# EAGLE design atsamdg21_rtc (EAGLE 9.5.1)
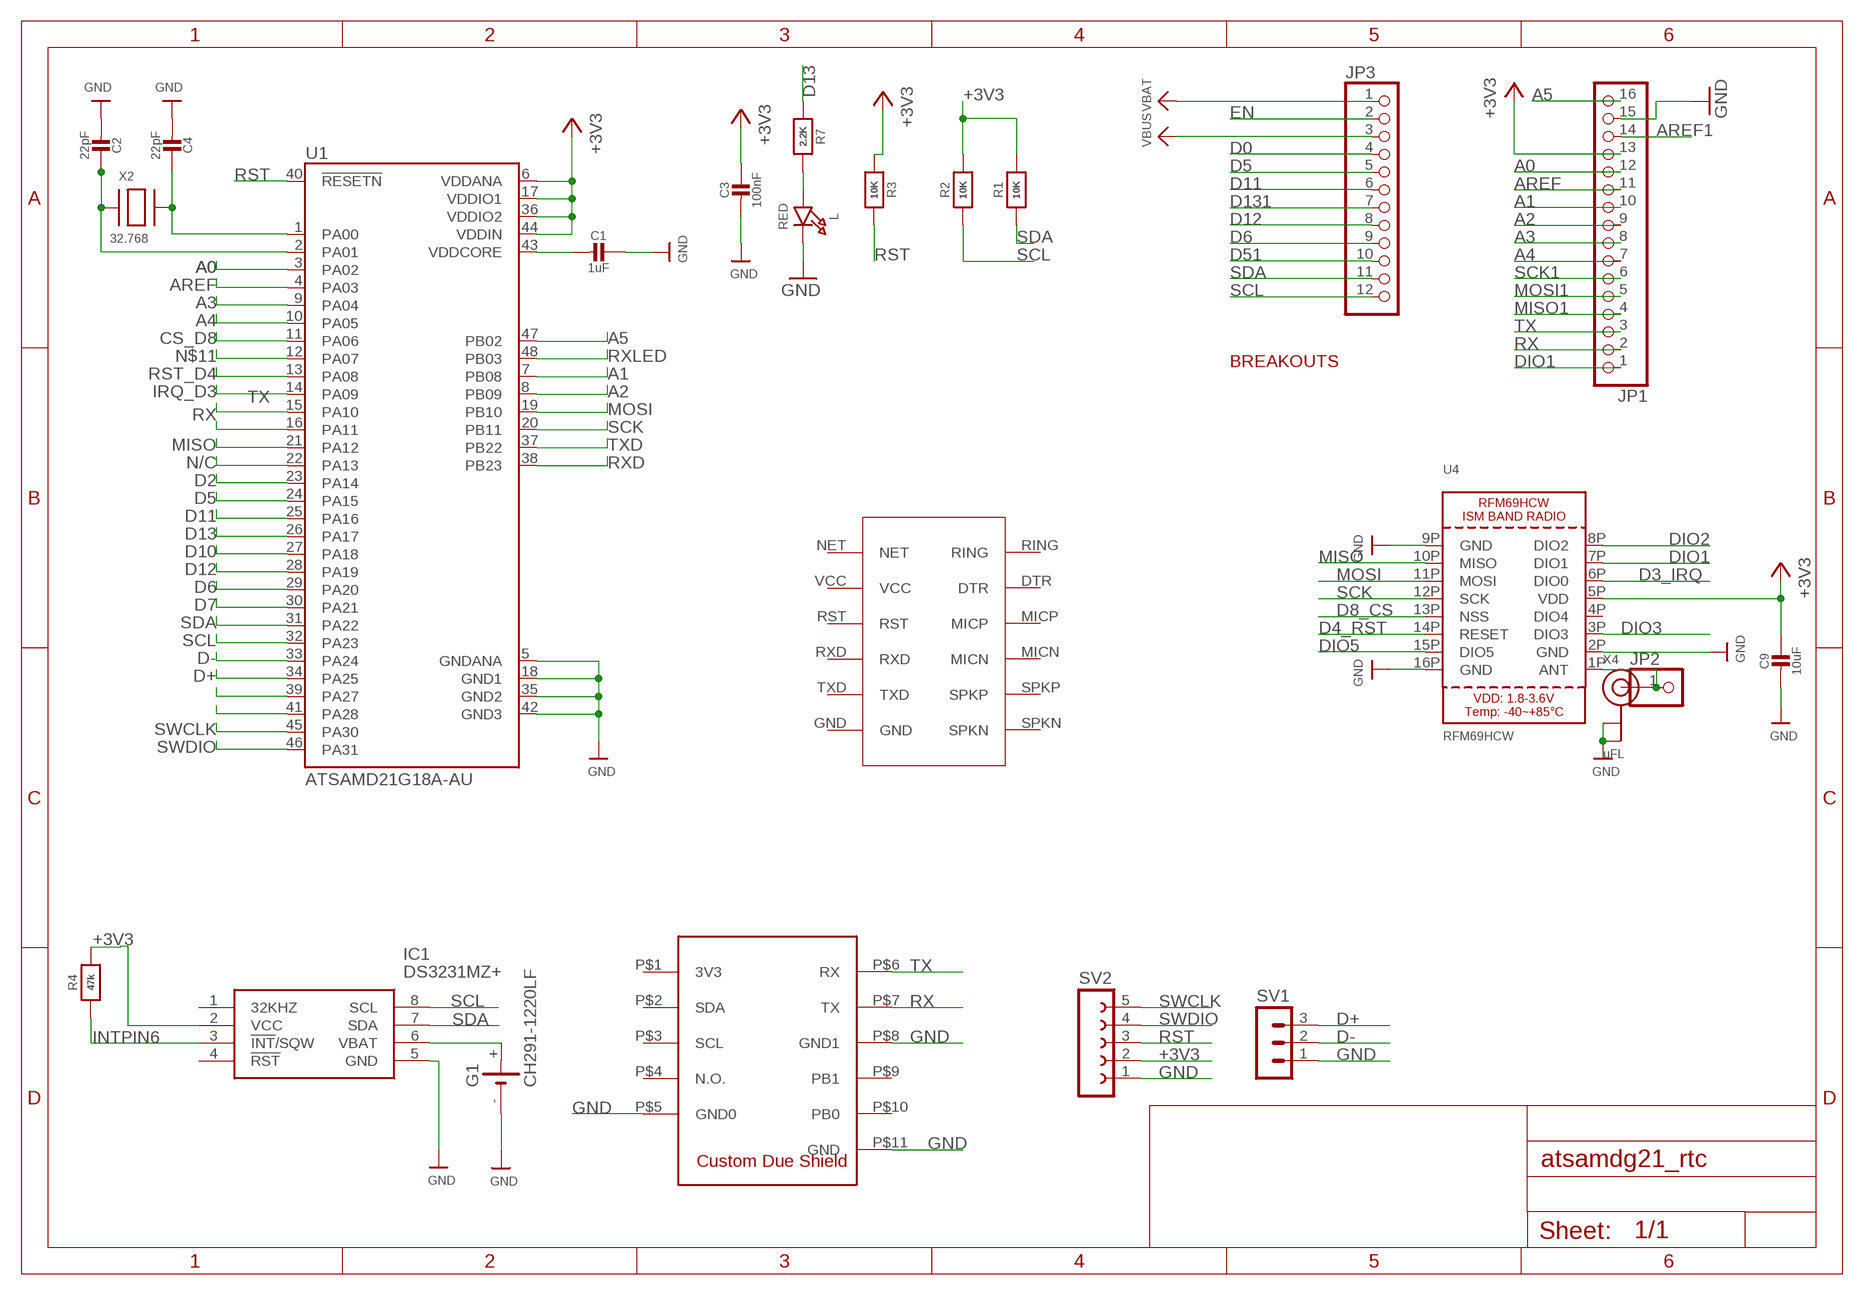
[diagram p0: schematic, sheet 1]

## Parts
C1  1uF  CAP_CERAMIC0603_NO  [0603-NO]
C2  22pF  CAP_CERAMIC0603_NO  [0603-NO]
C3  100nF  CAP_CERAMIC0603_NO  [0603-NO]
C4  22pF  CAP_CERAMIC0603_NO  [0603-NO]
C9  10uF  CAP_CERAMIC0805-NOOUTLINE  [0805-NO]
G1  CH291-1220LF  [CH291-1220LF]
IC1  DS3231MZ+  [SOIC127P600X175-8N]
JP1  HEADER-1X16ROUND  [1X16_ROUND]
JP2  HEADER-1X1ROUND  [1X01_ROUND]
JP3  HEADER-1X12  [1X12_ROUND]
L  RED  LED0805_NOOUTLINE  [CHIPLED_0805_NOOUTLINE]
R1  10K  RESISTOR_0603_NOOUT  [0603-NO]
R2  10K  RESISTOR_0603_NOOUT  [0603-NO]
R3  10K  RESISTOR_0603_NOOUT  [0603-NO]
R4  47k  RESISTOR_0603_NOOUT  [0603-NO]
R7  2.2K  RESISTOR_0603_NOOUT  [0603-NO]
SV1  MA03-1  [MA03-1]
SV2  FE05-1  [FE05-1]
U1  ATSAMD21G18A-AU  [QFP50P900X900X120-48N]
U4  RFM69HCW  RFM69HCW_SMT  [RFMHCW_SMT]
U$7  SIM800L_MODULE  [SIM800L]
U$9  DUE_PADS  [DUESHIELD]
X2  32.768  XTAL-3.2X1.5  [XTAL3215]
X4  uFL  ANTENNA_U.FL  [U.FL]

## Nets
+3V3: C3.1 C9.1 IC1.2(VCC) JP1.13 R1.2 R2.2 R3.1 R4.2 SV2.2 U1.6(VDDANA) U1.17(VDDIO1) U1.36(VDDIO2) U1.44(VDDIN) U4.5P(VDD)
A0: JP1.12 U1.3(PA02)
A1: JP1.10 U1.7(PB08)
A2: JP1.9 U1.8(PB09)
A3: JP1.8 U1.9(PA04)
A4: JP1.7 U1.10(PA05)
A5: JP1.16 U1.47(PB02)
ANT: JP2.1 U4.1P(ANT) X4.3(SIGNAL)
AREF: JP1.11 U1.4(PA03)
AREF1: JP1.14
CS_D8: U1.11(PA06)
D0: JP3.4
D2: U1.23(PA14)
D3_IRQ: U4.6P(DIO0)
D4_RST: U4.14P(RESET)
D5: JP3.5 U1.24(PA15)
D6: JP3.9 U1.29(PA20)
D7: U1.30(PA21)
D8_CS: U4.13P(NSS)
D10: U1.27(PA18)
D11: JP3.6 U1.25(PA16)
D12: JP3.8 U1.28(PA19)
D13: R7.1 U1.26(PA17)
D51: JP3.10
D131: JP3.7
D+: SV1.3 U1.34(PA25)
D-: SV1.2 U1.33(PA24)
DIO1: JP1.1 U4.7P(DIO1)
DIO2: U4.8P(DIO2)
DIO3: U4.3P(DIO3)
DIO5: U4.15P(DIO5)
EN: JP3.2
GND: C1.1 C2.2 C3.2 C4.2 C9.2 G1.- IC1.5(GND) JP1.15 L.C SV1.1 SV2.1 U1.5(GNDANA) U1.18(GND1) U1.35(GND2) U1.42(GND3) U4.2P(GND) U4.9P(GND) U4.16P(GND) U$9.P$5(GND0) U$9.P$8(GND1) U$9.P$11(GND) X4.1(GND) X4.2(GND)
INTPIN6: IC1.3(!INT!/SQW) R4.1
IRQ_D3: U1.14(PA09)
MISO: U1.21(PA12) U4.10P(MISO)
MISO1: JP1.4
MOSI: U1.19(PB10) U4.11P(MOSI)
MOSI1: JP1.5
N$1: C1.2 U1.43(VDDCORE)
N$2: G1.+ IC1.6(VBAT)
N$5: C2.1 U1.2(PA01) X2.P$1
N$7: C4.1 U1.1(PA00) X2.P$2
N$11: U1.12(PA07)
N$30: U1.39(PA27)
N$31: U1.41(PA28)
N$40: L.A R7.2
N/C: U1.22(PA13)
RST: R3.2 SV2.3 U1.40(!RESETN)
RST_D4: U1.13(PA08)
RX: JP1.2 U1.16(PA11) U$9.P$7(TX)
RXD: U1.38(PB23)
RXLED: U1.48(PB03)
SCK: U1.20(PB11) U4.12P(SCK)
SCK1: JP1.6
SCL: IC1.8(SCL) JP3.12 R2.1 U1.32(PA23)
SDA: IC1.7(SDA) JP3.11 R1.1 U1.31(PA22)
SWCLK: SV2.5 U1.45(PA30)
SWDIO: SV2.4 U1.46(PA31)
TX: JP1.3 U1.15(PA10) U$9.P$6(RX)
TXD: U1.37(PB22)
VBAT: JP3.1
VBUS: JP3.3
Unconnected: IC1.1(32KHZ) IC1.4(!RST) U4.4P(DIO4) U$7.DTR U$7.GND U$7.MICN U$7.MICP U$7.NET U$7.RING U$7.RST U$7.RXD U$7.SPKN U$7.SPKP U$7.TXD U$7.VCC U$9.P$1(3V3) U$9.P$2(SDA) U$9.P$3(SCL) U$9.P$4(N.O.) U$9.P$9(PB1) U$9.P$10(PB0)

## Notes on the sheet
- BREAKOUTS

## Library data of the parts
C1-C4 C9 = microbuilder:CAP_CERAMIC: Ceramic Capacitors For new designs, use the packages preceded by an '_' character since they are more reliable: The following footprints should be used on most boards: _0402 - Standard footprint for regular board layouts _0603 - Standard footprint for regular board layouts _0805 - Standard footprint for regular board layouts _1206 - Standard footprint for regular board layouts For extremely tight-pitch boards where space is at a premium, the following 'micro-pitch' footprints can be used (smaller pads, no silkscreen outline, etc.): _0402MP - Micro-pitch footprint for very dense/compact boards _0603MP - Micro-pitch footprint for very dense/compact boards _0805MP - Micro-pitch footprint for very dense/compact boards _1206MP - Micro-pitch footprint for very dense/compact boards
G1 = battery:CH291-1220LF: Battery Holder, SMT, 12mm multicomp PART NO. CH291-1220LF Source: Data sheet <http://www.farnell.com/datasheets/1505860.pdf>
IC1 = DS3231MZ+:DS3231MZ+: Real Time Clock 5+/-ppm RTC Source: Datasheet <http://uk.rs-online.com/web/p/products/1897249>; DESCRIPTION: Real Time Clock 5+/-ppm RTC; HEIGHT: 1.75mm; MANUFACTURER_NAME: Maxim Integrated; MANUFACTURER_PART_NUMBER: DS3231MZ+; RS_PART_NUMBER: 1897249; RS_PRICE-STOCK: http://uk.rs-online.com/web/p/products/1897249
JP1 = microbuilder:HEADER-1X16: PIN HEADER
JP2 = microbuilder:HEADER-1X1: PIN HEADER
JP3 = microbuilder:HEADER-1X12
L = microbuilder:LED: LED 0603 - 0603 Surface Mount Package 2mA: Green LED - Low Power (3.9mcd, 2ma, 1.7Vf) - Digikey: 475-2709-2-ND Orange LED - Low Power (9.8mcd, 2ma, 1.8Vf) - Digikey: 475-1194-2-ND Red LED - Low Power (5mcd, 2ma, 1.8Vf) - Digikey: 475-1195-2-ND Yellow LED - Low Power (7mcd, 2ma, 1.8Vf) - Digikey: 475-1196-2-ND 5mA: Blue LED - Low Power (17mcd, 5ma, 2.9Vf) - Digikey: LNJ937W8CRACT-ND 0805 - 0805 Surface Mount Package 2mA: Red LED (8.8mcd, 2mA, 1.8Vf, Clear) - Low Power [Digikey: 475-2510-1-ND] Green LED (5mcd, 2mA, 1.8Vf, Clear) - Low Power [Digikey: 475-2730-1-ND] Yellow LED (11.3mcd, 2mA, 1.8Vf, Clear) - Low Power [Digikey: 475-2555-1-ND] 20mA: Red LED (104mcd, 20mA, Diffused) - LS R976 [Digikey: 475-1278-6-ND] Red LED (12mcd, 20mA, 2.0Vf, Clear) - APT2012EC [Digikey: 754-1128-1-ND] Green LED (15mcd, 20mA, 2.2Vf, Clear) - APT2012GC [Digikey: 754-1131-1-ND] Orange LED (160mcd, 20mA, 2.1Vf, Clear) - APT2012SECK [Digikey: 754-1130-1-ND] 1206 - 1206 Surface Mount Package Green LED (26mcd, 20mA, Diffused) - LG N971 [Digikey: 475-1407-6-ND] Red LED (15mcd, 20mA, Diffused) - LH N974 [Digikey: 475-1416-6-ND] Cree - Cree High-Power Surface Mount LEDs XPEBWT-L1-0000-00D50 - White 111lm 350mA 2.9Vf 6200K 110° XTEAWT-00-0000-00000LEE3 - White 114lm 350mA 2.85Vf 5000K 115° Everlight - Everlight 45-21 Series Surface Mount LEDs 45-21/QK2C-B2832AC2CB2/2T - Warm White 2000mcd 20mA 3.25Vf 3050K 120° 45-21/LK2C-B38452C4CB2/2T - Nuetral White 2000mcd 20mA 3.25Vf 4150K 120° 45-21/LK2C-B50634C6CB2/2T - Cold White 2200mcd 20mA 3.25Vf 5650K 120° PLCC2 Reverse Mount LS T77K-J1L2-1-0-2-R18-Z - Red 11.25mcd 2mA 1.8Vf 630nm 120° LO T77K-L1M2-24-Z - Orange 19.6mcd 2mA 1.8Vf 606nm 120° LY T77K-K2M1-26-Z - Yellow 15.7mcd 2mA 1.8Vf 587nm 120°
R1-R4 R7 = microbuilder:RESISTOR: Resistors For new designs, use the packages preceded by an '_' character since they are more reliable: The following footprints should be used on most boards: _0402 - Standard footprint for regular board layouts _0603 - Standard footprint for regular board layouts _0805 - Standard footprint for regular board layouts _1206 - Standard footprint for regular board layouts For extremely tight-pitch boards where space is at a premium, the following 'micro-pitch' footprints can be used (smaller pads, no silkscreen outline, etc.): _0402MP - Micro-pitch footprint for very dense/compact boards _0603MP - Micro-pitch footprint for very dense/compact boards _0805MP - Micro-pitch footprint for very dense/compact boards _1206MP - Micro-pitch footprint for very dense/compact boards
SV1 = con-lstb:MA03-1: PIN HEADER; OC_FARNELL: unknown; OC_NEWARK: unknown
SV2 = con-lsta:FE05-1: FEMALE HEADER; OC_FARNELL: unknown; OC_NEWARK: unknown
U1 = ATSAMD21G18A-AU:ATSAMD21G18A-AU: Cortex-M0+, 256KB FLASH, 32KB SRAM, USB, DMA, T&R - 48TQFP IND TEMP, GREEN, 1.6-3.6V, 48MHz; AVAILABILITY: Unavailable; DESCRIPTION: SAMD21G Series 256 kB Flash 32 kB SRAM 48 MHz 32-Bit Microcontroller - TQFP-48; MF: Microchip; MP: ATSAMD21G18A-AU; PACKAGE: TQFP-48 Microchip; PRICE: None
U4 = microbuilder:RFM69HCW: RFM69HCW - ISM Band RF Transceiver
U$7 = sim800L_module:SIM800L_MODULE
U$9 = due_shield_pad:DUE_PADS
X2 = adafruit2:XTAL: Low cost SMT crystals, no capacitors included http://www.ladyada.net/library/eagle
X4 = microbuilder:ANTENNA_U.FL: U.FL Antenna Connector

## Board
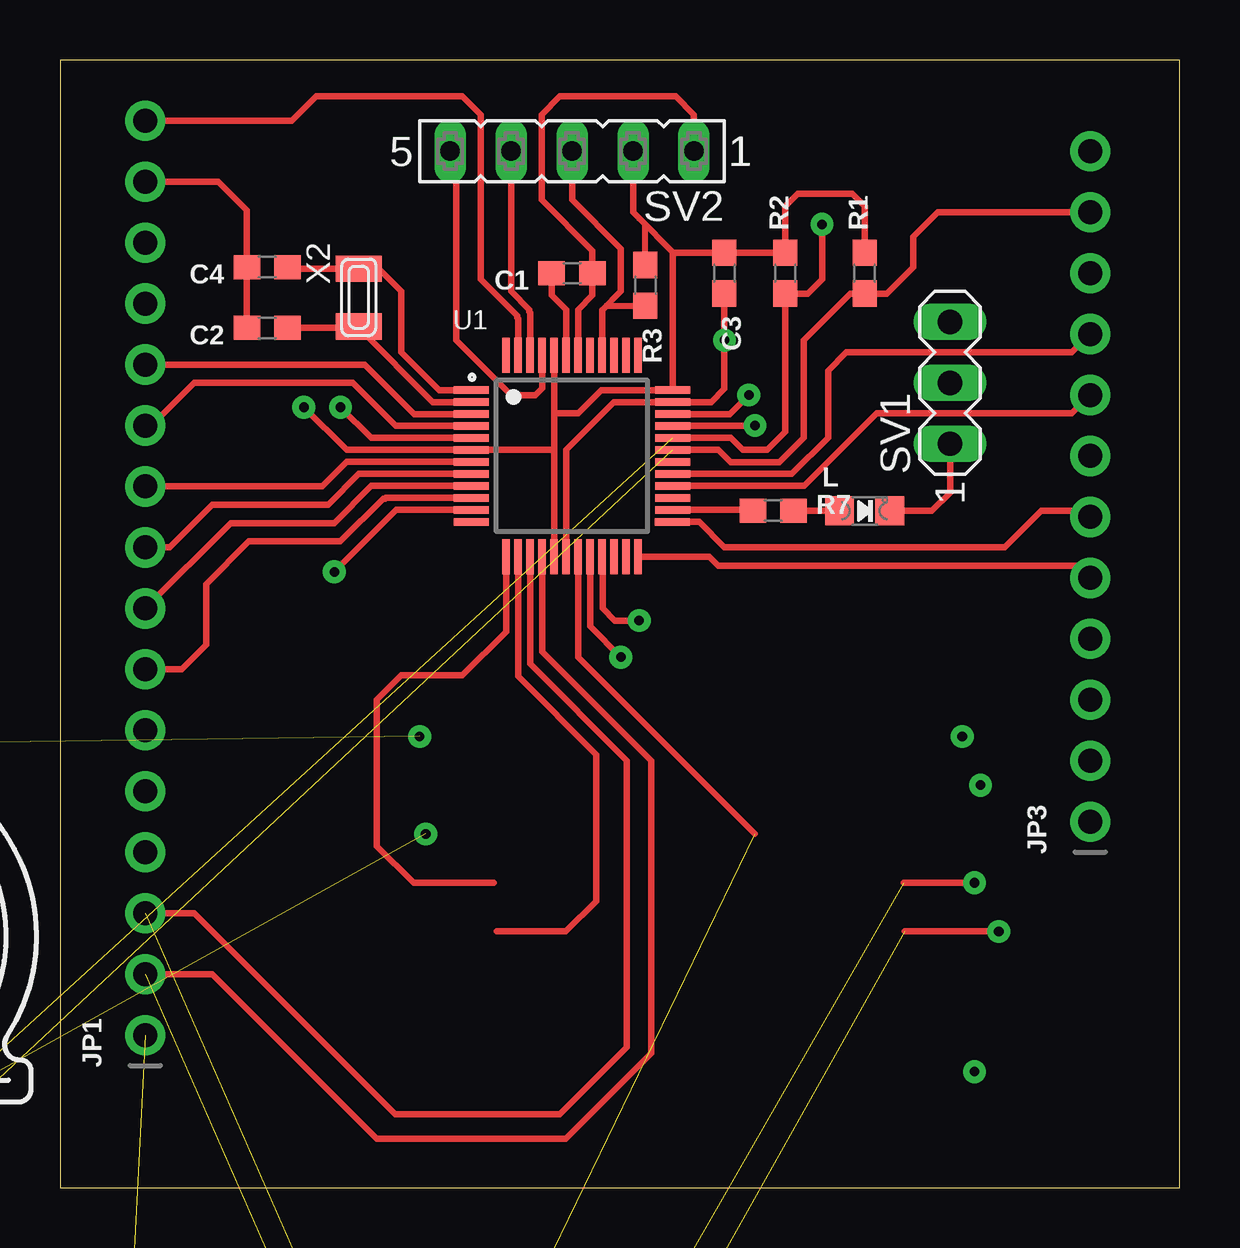
[diagram p1: board, top side]
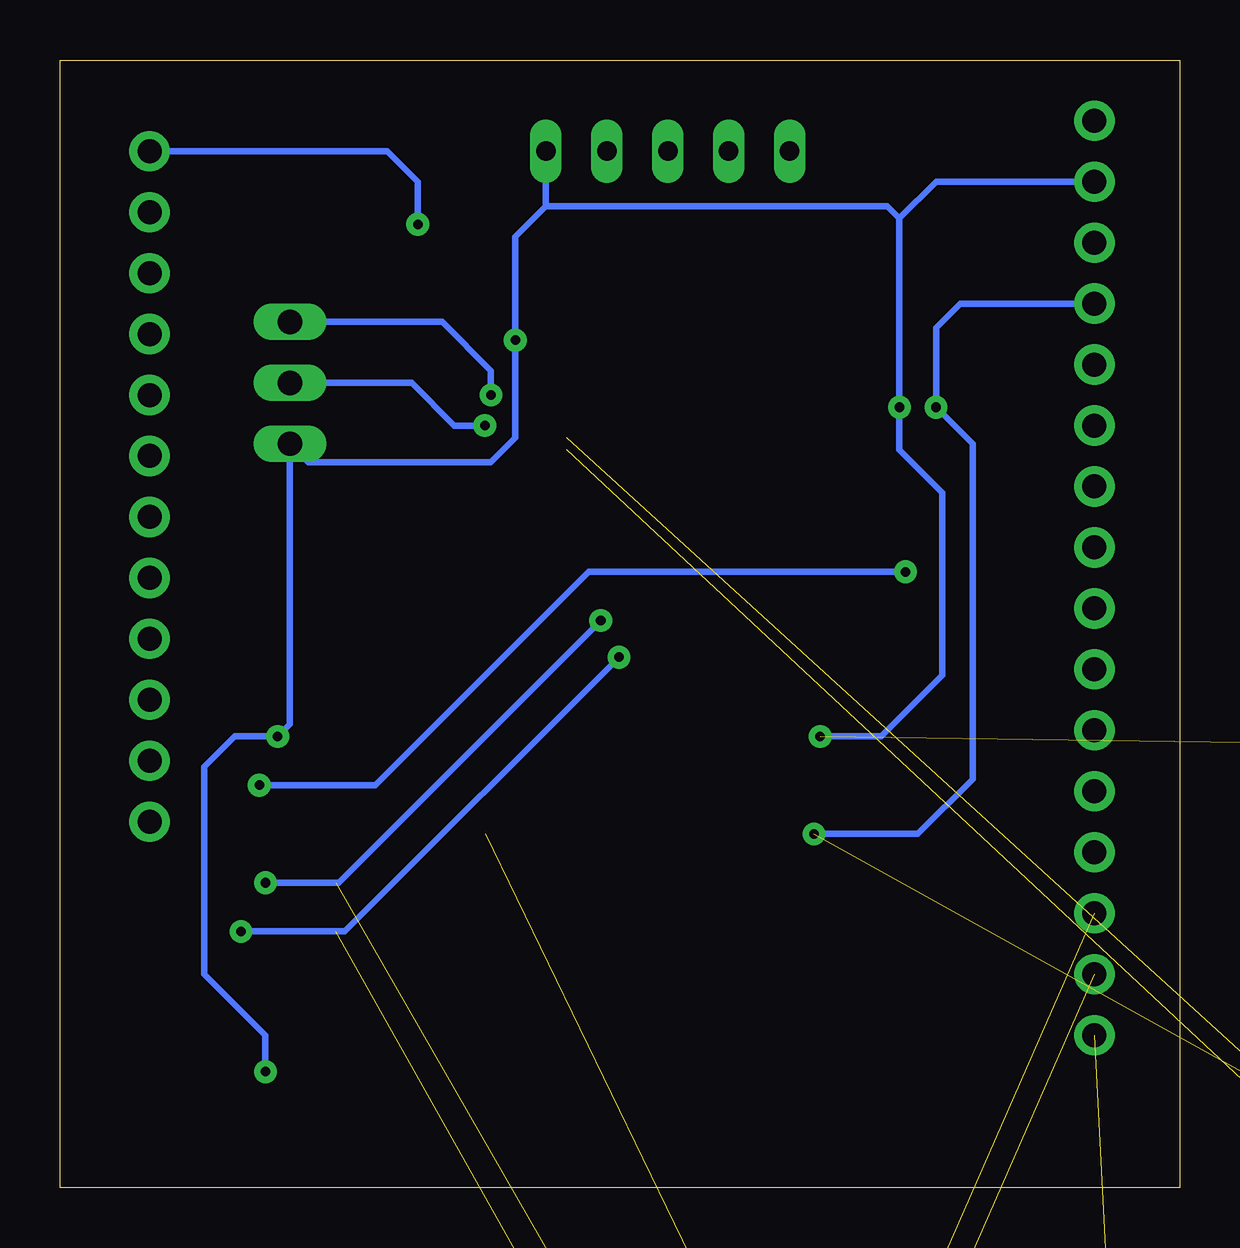
[diagram p2: board, bottom side, seen from below]

Size 46.66 x 46.98 mm. Coordinates in mm from the lower left corner, seen from the top.
Outline: 0,0 46.66,0 46.66,46.98 0,46.98 0,0
Copper layers (1*16): Top 0.035mm / dielectric 1.5mm / Bottom 0.035mm
Design rules "default": minimum track width 6mil, minimum drill 0.35mm, track to track 6mil, track to pad 6mil, pad to pad 6mil, via to via 6mil, smd to smd 6mil, copper to edge 40mil, drill to drill 6mil, minimum pad ring 10mil, minimum via ring 8mil, stop-mask expansion 4mil, vias tented up to drill 0mil, thermal gap 10mil

### Footprints (pad centres in the part's own frame; a part is rotated, then mirrored left to right if it is on the bottom)
0603-NO = smd 1.1 x 1: 1 -0.85,0; 2 0.85,0
0805-NO = smd 1.24 x 1.5: 1 -0.95,0; 2 0.95,0
CH291-1220LF = smd 2.3 x 3.66: + 0,-2.296 | smd 2.3 x 4.3: - 0,14.146 | hole 1.3: 0,2 | hole 1: 0,9.5
SOIC127P600X175-8N = smd 1.525 x 0.65: 1 -2.712,1.905; 2 -2.712,0.635; 3 -2.712,-0.635; 4 -2.712,-1.905; 5 2.712,-1.905; 6 2.712,-0.635; 7 2.712,0.635; 8 2.712,1.905
1X16_ROUND = drill 1 pad 1.676: 1 -19.05,0; 2 -16.51,0; 3 -13.97,0; 4 -11.43,0; 5 -8.89,0; 6 -6.35,0; 7 -3.81,0; 8 -1.27,0; 9 1.27,0; 10 3.81,0; 11 6.35,0; 12 8.89,0; 13 11.43,0; 14 13.97,0; 15 16.51,0; 16 19.05,0
1X01_ROUND = drill 1 pad 1.676: 1 0,0
1X12_ROUND = drill 1 pad 1.676: 1 -13.97,0; 2 -11.43,0; 3 -8.89,0; 4 -6.35,0; 5 -3.81,0; 6 -1.27,0; 7 1.27,0; 8 3.81,0; 9 6.35,0; 10 8.89,0; 11 11.43,0; 12 13.97,0
CHIPLED_0805_NOOUTLINE = smd 1.2 x 1.2: A 0,-1.05; C 0,1.05
MA03-1 = drill 1.016 long: 1 -2.54,0; 2 0,0; 3 2.54,0
FE05-1 = drill 0.813 long: 1 -5.08,0; 2 -2.54,0; 3 0,0; 4 2.54,0; 5 5.08,0
QFP50P900X900X120-48N = smd 1.45 x 0.3: 1 -4.2,2.75; 2 -4.2,2.25; 3 -4.2,1.75; 4 -4.2,1.25; 5 -4.2,0.75; 6 -4.2,0.25; 7 -4.2,-0.25; 8 -4.2,-0.75; 9 -4.2,-1.25; 10 -4.2,-1.75; 11 -4.2,-2.25; 12 -4.2,-2.75; 25 4.17,-2.75; 26 4.2,-2.25; 27 4.2,-1.75; 28 4.2,-1.25; 29 4.2,-0.75; 30 4.2,-0.25; 31 4.2,0.25; 32 4.2,0.75; 33 4.2,1.25; 34 4.2,1.75; 35 4.2,2.25; 36 4.2,2.75 | smd 0.3 x 1.45: 13 -2.75,-4.2; 14 -2.25,-4.2; 15 -1.75,-4.2; 16 -1.25,-4.2; 17 -0.75,-4.2; 18 -0.25,-4.2; 19 0.25,-4.2; 20 0.75,-4.2; 21 1.25,-4.2; 22 1.75,-4.2; 23 2.25,-4.2; 24 2.75,-4.2; 37 2.75,4.2; 38 2.25,4.2; 39 1.75,4.2; 40 1.25,4.2; 41 0.75,4.2; 42 0.25,4.2; 43 -0.25,4.2; 44 -0.75,4.2; 45 -1.25,4.2; 46 -1.75,4.2; 47 -2.25,4.2; 48 -2.75,4.2
RFMHCW_SMT = smd 1.5 x 1: 1P 8.1,-7; 2P 8.1,-5; 3P 8.1,-3; 4P 8.1,-1; 5P 8.1,1; 6P 8.1,3; 7P 8.1,5; 8P 8.1,7; 9P -8.1,7; 10P -8.1,5; 11P -8.1,3; 12P -8.1,1; 13P -8.1,-1; 14P -8.1,-3; 15P -8.1,-5; 16P -8.1,-7
SIM800L = drill 1 long: DTR 11.176,1.27; GND -10.414,-6.35; MICN 11.176,-3.81; MICP 11.176,-1.27; NET -10.414,6.35; RING 11.176,3.81; RST -10.414,1.27; RXD -10.414,-1.27; SPKN 11.176,-8.89; SPKP 11.176,-6.35; TXD -10.414,-3.81; VCC -10.414,3.81
DUESHIELD = drill 1 long: P$1 -21.082,8.89; P$2 -21.082,6.35; P$3 -21.082,3.81; P$4 -21.082,1.27; P$5 -21.082,-1.27; P$6 21.59,3.048; P$7 21.59,0.508; P$8 21.59,-2.032; P$9 21.59,-4.572; P$10 21.59,-7.112; P$11 21.59,-9.652
XTAL3215 = smd 1.1 x 1.9: P$1 1.2,0; P$2 -1.2,0
U.FL = smd 2.2 x 1.05: 1 0,1.375; 2 0,-1.375 | smd 0.8 x 1: 3 1.525,0

### Placement (x,y rotation side)
C1  21.34,38.1 180 top
C2  8.64,35.81 180 top
C3  27.69,38.1 270 top
C4  8.64,38.35 180 top
C9  -9.14,-93.47 0 top  (outside the outline)
G1  -8.64,4.32 0 top  (outside the outline)
IC1  -12.45,-2.79 0 top  (outside the outline)
JP1  3.56,25.4 90 top
JP2  -11.94,-95.5 0 top  (outside the outline)
JP3  42.93,29.21 90 top
L  33.53,28.19 270 top
R1  33.53,38.1 90 top
R2  30.23,38.1 90 top
R3  24.38,37.59 270 top
R4  -16.26,-6.86 0 top  (outside the outline)
R7  29.72,28.19 0 top
SV1  37.08,33.53 90 top
SV2  21.34,43.18 180 top
U1  21.34,30.48 0 top
U4  -8.89,-83.06 0 top  (outside the outline)
U$7  -5.59,-19.81 0 top  (outside the outline)
U$9  8.38,-51.82 0 top  (outside the outline)
X2  12.45,37.08 270 top
X4  -16,-96.52 0 top  (outside the outline)

### Tracks (layer width: path | path; a pad name or v marks a point on that pad's centre or on a via)
+3V3  (via drill 0.4 pad 0.95)  (4 unrouted)
  Top 0.254: R3.1 24.38,40.13 24.13,40.39
  Top 0.279: U1.44 20.59,32.26 | 20.59,32.26 20.59,30.73 | 20.59,30.73 U1.17 | 20.59,30.73 20.58,30.73 U1.6 11.94,30.73 v10.16,32.51 | 20.59,32.26 21.59,32.26 22.56,33.23 U1.36 25.54,38.98 | SV2.2 23.88,40.64 24.13,40.39 25.54,38.98 | 25.54,38.98 25.57,38.95 C3.1 R2.2 30.23,40.89 30.73,41.4 33.02,41.4 33.53,40.89 R1.2 | v15.25,14.74 v15.24,14.73
  Bottom 0.279: JP1.13 9.14,36.83 10.16,35.81 v10.16,32.51 8.64,30.99 8.64,17.02 10.92,14.73 v15.24,14.73
A0
  Top 0.279: U1.3 14.76,32.23 12.7,34.29 JP1.12
A1
  Top 0.279: U1.7 11.94,30.23 10.92,29.21 JP1.10
A2
  Top 0.279: U1.8 12.46,29.73 11.18,28.45 6.35,28.45 4.57,26.67 JP1.9
A3
  Top 0.279: U1.9 12.97,29.23 11.43,27.69 7.11,27.69 JP1.8
A4
  Top 0.279: U1.10 13.58,28.73 13.55,28.7 13.46,28.7 11.68,26.92 7.87,26.92 6.1,25.15 6.1,22.61 5.08,21.59 JP1.7
A5
  Top 0.279: U1.47 19.09,36.2 19.05,36.24 19.05,36.32 17.53,37.85 17.53,44.7 16.76,45.47 10.67,45.47 9.65,44.45 JP1.16
ANT  (2 unrouted)
AREF
  Top 0.279: 3.58,31.73 JP1.11 3.81,31.75 5.59,33.53 12.19,33.53 13.99,31.73 U1.4
CS_D8  (via drill 0.4 pad 0.95)
  Top 0.279: U1.11 14.01,28.23 v11.43,25.65 | v38.35,16.76 38.33,16.74
  Bottom 0.279: v11.43,25.65 24.64,25.65 33.53,16.76 v38.35,16.76
D5
  Top 0.279: U1.24 27.06,26.28 27.43,25.91 42.42,25.91 JP3.5
D6
  Top 0.279: JP3.9 42.16,34.8 32.77,34.8 32,34.04 32,31.24 30.49,29.73 U1.29
D11
  Top 0.279: U1.25 26.63,27.73 27.69,26.67 39.37,26.67 40.89,28.19 42.67,28.19 JP3.6
D12
  Top 0.279: U1.28 31.01,29.23 34.04,32.26 42.16,32.26 JP3.8
D13
  Top 0.279: U1.26 28.83,28.23 R7.1
D+  (via drill 0.4 pad 0.95)
  Top 0.279: U1.34 27.91,32.23 v28.7,33.02
  Bottom 0.279: v28.7,33.02 28.7,34.04 30.73,36.07 SV1.3
D-  (via drill 0.4 pad 0.95)
  Top 0.279: U1.33 28.94,31.73 v28.96,31.75
  Bottom 0.279: v28.96,31.75 30.23,31.75 32,33.53 SV1.2
DIO1  (1 unrouted)
GND  (via drill 0.4 pad 0.95)  (11 unrouted)
  Top 0.279: C2.2 C4.2 7.79,40.73 6.6,41.91 JP1.15 | U1.42 21.59,36.57 22.19,37.17 C1.1 22.19,39.03 20.07,41.15 20.07,44.7 20.83,45.47 25.65,45.47 26.42,44.7 SV2.1 | U1.18 21.09,30.74 23.08,32.73 U1.35 27.14,32.73 27.69,33.27 v27.69,35.31 C3.2 | 17.15,31.24 U1.5 12.97,31.23 v11.68,32.51 | L.C 36.32,28.19 37.08,28.96 SV1.1 | 15.04,18.74 v14.99,18.8 | 37.54,18.74 v37.59,18.8 | 38.01,4.74 v38.1,4.83
  Bottom 0.279: 26.42,40.89 27.69,39.62 v27.69,35.31 27.69,31.24 28.7,30.23 36.32,30.23 SV1.1 37.08,19.3 v37.59,18.8 39.37,18.8 40.64,17.53 40.64,8.89 38.1,6.35 v38.1,4.83 | 26.42,40.89 SV2.1 | 11.68,40.39 v11.68,32.51 11.68,30.73 9.91,28.96 9.91,21.34 12.45,18.8 v14.99,18.8 | 11.68,40.39 10.16,41.91 JP1.15 | 11.68,40.39 12.19,40.89 26.42,40.89
INTPIN6  (1 unrouted)
IRQ_D3
  Top 0.279: U1.14 19.09,21.3 22.35,18.03 22.35,11.94 21.08,10.67 18.19,10.67
MISO  (via drill 0.4 pad 0.95)  (1 unrouted)
  Top 0.279: U1.21 22.61,26.26 22.61,24.13 23.11,23.62 v24.13,23.62 | v38.1,12.7 35.16,12.7
  Bottom 0.279: v24.13,23.62 35.05,12.7 v38.1,12.7
MOSI  (1 unrouted)
  Top 0.279: U1.19 21.59,22.1 28.95,14.74
N$1
  Top 0.279: U1.43 21.09,36.57 20.49,37.17 C1.2
N$2  (1 unrouted)
N$5
  Top 0.279: 12.81,35.52 X2.P$1 | X2.P$1 12.38,35.81 C2.1 | U1.2 15.53,32.73 12.45,35.81 X2.P$1
N$7
  Top 0.279: C4.1 9.56,38.28 X2.P$2 13.28,38.28 14.22,37.34 14.22,34.8 15.79,33.23 U1.1
N$40
  Top 0.279: R7.2 L.A
RST
  Top 0.254: 22.59,36.56 22.77,36.74 R3.2
  Top 0.279: U1.40 22.59,36.56 23.37,37.34 23.37,39.12 21.34,41.15 SV2.3
RST_D4
  Top 0.279: 18.08,12.7 14.73,12.7 13.21,14.22 13.21,20.32 14.22,21.34 16.76,21.34 18.59,23.16 U1.13
RX  (1 unrouted)
  Top 0.279: U1.16 20.09,22.33 24.64,17.78 24.64,5.59 21.08,2.03 13.21,2.03 6.35,8.89 JP1.2
SCK  (via drill 0.4 pad 0.95)  (1 unrouted)
  Top 0.279: U1.20 22.09,23.38 v23.37,22.1 | v39.12,10.67 35.19,10.67
  Bottom 0.279: v23.37,22.1 34.8,10.67 v39.12,10.67
SCL  (via drill 0.4 pad 0.95)  (1 unrouted)
  Top 0.279: U1.32 27.95,31.23 28.45,30.73 29.46,30.73 30.23,31.5 R2.1 31.15,37.25 31.75,37.85 v31.75,40.13
  Bottom 0.279: v31.75,40.13 31.75,41.91 33.02,43.18 JP3.12
SDA  (1 unrouted)
  Top 0.279: U1.31 27.44,30.73 27.94,30.23 29.97,30.23 30.99,31.24 30.99,35.31 32.93,37.25 R1.1 34.46,37.25 35.56,38.35 35.56,39.62 36.58,40.64 JP3.11
SWCLK
  Top 0.279: U1.45 20.09,33.29 19.81,33.02 18.8,33.02 16.51,35.31 16.51,42.93 SV2.5
SWDIO
  Top 0.279: U1.46 19.59,36.46 19.56,36.49 19.56,36.58 18.8,37.34 SV2.4
TX  (1 unrouted)
  Top 0.279: U1.15 19.59,21.82 23.62,17.78 23.62,5.84 20.83,3.05 13.97,3.05 5.59,11.43 JP1.3